# Altium project PCB_Project.PrjPcb
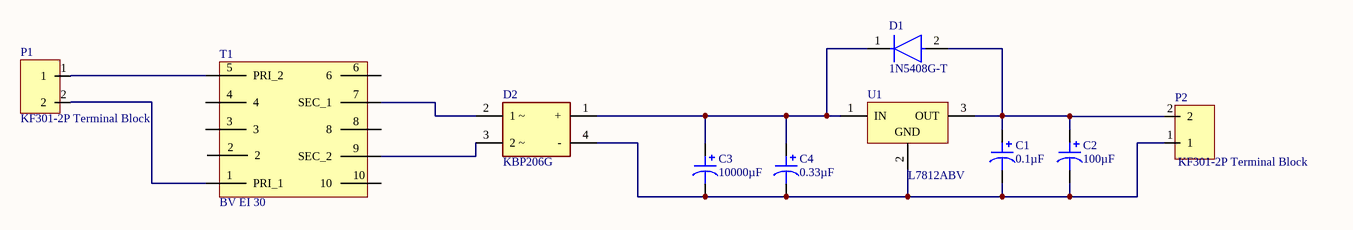
[diagram p0: Sheet2.SchDoc]
1 sheet, 10 parts. Net scope: global (net labels, ports and power ports of the same name join across sheets).
Board file: PCB2.PcbDoc

## Sheet Sheet2.SchDoc
size A4; SheetNumber: 1; SheetTotal: 1

### Parts
C1  0.1µF  [CAP TH ALUM ELEC D5.00mm S2.00mm H12.50mm]
C2  100µF  [CAP TH ALUM ELEC D8.00mm S3.50mm H13.00mm]
C3  10000µF  [CAP TH ALUM ELEC D30.00mm S10.00mm H42.00mm]
C4  0.33µF  [CAP TH ALUM ELEC D4.00mm S1.50mm H6.00mm]
D1  1N5408G-T  [FP-DO-201AD-MFG]
D2  KBP206G  [FP-KBP-MFG]
P1  KF301-2P Terminal Block  [KF301-2P PCB layout]
P2  KF301-2P Terminal Block  [KF301-2P PCB layout]
T1  BV EI 30  [PCBComponent_1]
U1  L7812ABV  [TO220]

### Nets
NetC1_1: C1.1 C2.1 D1.2(A) P2.2 U1.3(OUT)
NetC1_2: C1.2 C2.2 C3.2 C4.2 D2.4(-) P2.1 U1.2(GND)
NetC3_1: C3.1 C4.1 D1.1(C) D2.1(+) U1.1(IN)
NetD2_2: D2.2(1_~) T1.7(SEC_1)
NetD2_3: D2.3(2_~) T1.9(SEC_2)
NetP1_1: P1.1 T1.5(PRI_2)
NetP1_2: P1.2 T1.1(PRI_1)

Not connected (* = marked no-connect by the designer): T1 2 3 4 6 8 10

### Library data of the parts
C1 = 860020672001: CAP ALUM 0.1UF 20% 50V RADIAL; manufacturer: Würth Elektronik; Lifetime @ Temp.: 2000 Hrs @ 105°C; Polarization: Polar; Ripple Current @ High Frequency: 2.21mA @ 100kHz; Ripple Current @ Low Frequency: 1.3mA @ 120Hz; Part Number: 860020672001; Applications: General Purpose; Capacitance: 0.1µF; componentlink1description: Datasheet; componentlink1url: https://katalog.we-online.de/pbs/datasheet/860020672001.pdf; componentlink2description: DigiKey Link; componentlink2url: http://digikey.com/product-detail/en/w-rth-elektronik/860020672001/732-8847-1-ND/5728792; Device Package: Radial, Can; Height - Seated (Max): 0.492" (12.50mm); lastupdated: 4.09.2020 23:29:03; Lead Spacing: 0.079" (2.00mm); Lifecycle Status: Active; Minimum Order: 1; Mounting Type: Through Hole; Operating Temperature: -40°C ~ 105°C; Package / Case: Radial, Can; packaging: TapeAndBox; partid: 22421; Part Status: Active; price: 0.06; series: WCAP-ATG5; Size / Dimension: 0.197" Dia (5.00mm); Supplier 1: DigiKey; Supplier Part Number 1: 732-8847-1-ND; Tolerance: ±20%; value: 0.1µF; Voltage - Rated: 50V
C2 = 50YXG100MEFC8X11.5: CAP ALUM 100UF 20% 50V RADIAL; manufacturer: Rubycon; Impedance: 170 mOhms; Lifetime @ Temp.: 4000 Hrs @ 105°C; Polarization: Polar; Ripple Current @ High Frequency: 555mA @ 100kHz; Ripple Current @ Low Frequency: 277.5mA @ 120Hz; Part Number: 50YXG100MEFC8X11.5; Applications: General Purpose; Capacitance: 100µF; componentlink1description: Datasheet; componentlink1url: http://www.rubycon.co.jp/en/catalog/e_pdfs/aluminum/e_yxg.pdf; componentlink2description: DigiKey Link; componentlink2url: http://digikey.com/product-detail/en/rubycon/50YXG100MEFC8X11.5/1189-4021-ND/3563344; Device Package: Radial, Can; Height - Seated (Max): 0.512" (13.00mm); lastupdated: 7.09.2020 05:24:53; Lead Spacing: 0.138" (3.50mm); Lifecycle Status: Active; Minimum Order: 1; Mounting Type: Through Hole; Operating Temperature: -40°C ~ 105°C; Package / Case: Radial, Can; packaging: Bulk; partid: 23823; Part Status: Active; price: 0.43; series: YXG; Size / Dimension: 0.315" Dia (8.00mm); Supplier 1: DigiKey; Supplier Part Number 1: 1189-4021-ND; Tolerance: ±20%; value: 100µF; Voltage - Rated: 50V
C3 = LLS1H103MELB: CAP ALUM 10000UF 20% 50V SNAP; manufacturer: Nichicon; Lifetime @ Temp.: 3000 Hrs @ 85°C; Polarization: Polar; Ripple Current @ High Frequency: 5.842A @ 50kHz; Ripple Current @ Low Frequency: 5.08A @ 120Hz; Part Number: LLS1H103MELB; Applications: General Purpose; Capacitance: 10000µF; componentlink1description: Datasheet; componentlink1url: http://nichicon-us.com/english/products/pdfs/e-lls.pdf; componentlink2description: DigiKey Link; componentlink2url: http://digikey.com/product-detail/en/nichicon/LLS1H103MELB/493-6156-ND/2548862; Device Package: Radial, Can - Snap-In; Height - Seated (Max): 1.654" (42.00mm); lastupdated: 12.09.2020 10:14:53; Lead Spacing: 0.394" (10.00mm); Lifecycle Status: Active; Minimum Order: 1; Mounting Type: Through Hole; Operating Temperature: -40°C ~ 85°C; Package / Case: Radial, Can - Snap-In; packaging: Bulk; partid: 25520; Part Status: Active; price: 5.09; series: LLS; Size / Dimension: 1.181" Dia (30.00mm); Supplier 1: DigiKey; Supplier Part Number 1: 493-6156-ND; Tolerance: ±20%; value: 10000µF; Voltage - Rated: 50V
C4 = UMP1HR33MDD: CAP ALUM 0.33UF 20% 50V RADIAL; manufacturer: Nichicon; Lifetime @ Temp.: 2000 Hrs @ 85°C; Polarization: Bi-Polar; Ripple Current @ High Frequency: 4.2mA @ 10kHz; Ripple Current @ Low Frequency: 2.8mA @ 120Hz; Part Number: UMP1HR33MDD; Applications: General Purpose; Capacitance: 0.33µF; componentlink1description: Datasheet; componentlink1url: http://nichicon-us.com/english/products/pdfs/e-ump.pdf; componentlink2description: DigiKey Link; componentlink2url: http://digikey.com/product-detail/en/nichicon/UMP1HR33MDD/493-17656-ND/2598755; Device Package: Radial, Can; Height - Seated (Max): 0.236" (6.00mm); lastupdated: 6.09.2020 01:48:30; Lead Spacing: 0.059" (1.50mm); Lifecycle Status: Active; Minimum Order: 1; Mounting Type: Through Hole; Operating Temperature: -40°C ~ 85°C; Package / Case: Radial, Can; packaging: Bulk; partid: 23159; Part Status: Active; price: 0.42; series: UMP; Size / Dimension: 0.157" Dia (4.00mm); Supplier 1: DigiKey; Supplier Part Number 1: 493-17656-ND; Tolerance: ±20%; value: 0.33µF; Voltage - Rated: 50V
D1 = CMP-12791-000058-1: DIODE GEN PURP 1KV 3A DO201AD; Element Configuration: Single; Polarity: Standard; Max Reverse Current: 5uA; Reverse Recovery Time: 2us; Max Surge Current: 125A; Forward Voltage: 1.1V; Capacitance: 40pF; Series: -; Average Rectified Current: 3A; Weight: 0.038801oz; Package Quantity: 1200; RoHS Compliant: Yes; Radiation Hardening: No; Mount: Through Hole; Forward Current: 3A; Length: 9.5mm; Min Operating Temperature: -65°C; Height: 5.3mm; Voltage Rating (DC): 1kV; Number of Pins: 2; Lead Free: Lead Free; Reverse Voltage (DC): 1kV; Output Current: 3A; Max Repetitive Reverse Voltage (Vrrm): 1kV; Case/Package: DO-201AD; Peak Non-Repetitive Surge Current: 125A; Current Rating: 3A; Packaging: Tape and Reel; Max Operating Temperature: 150°C; Recovery Time: 2us; Width: 5.3mm; Max Reverse Voltage (DC): 1kV
D2 = CMP-12791-000035-1: BRIDGE RECT 1PHASE 600V 2A KBP; Manufacturer: Diodes Inc.; Capacitance: 25pF; Max Junction Temp: +150°C; Value: 25pF; Max Surge Forward Current: 65A; Peak Reverse Current: 5uA; Standoff Height: 1.8mm; Octopart: https://octopart.com/kbp206g-diodes+inc.-330175; Footprint Url: https://www.diodes.com/assets/Package-Files/KBP.pdf; Device Class L2: Diodes; Category: Diode; Reverse Voltage: 600V; Device Class L3: Rectifier Diodes; Manufacturer Part Number: KBP206G; Height: 12.8mm; Device Class L1: Discrete Semiconductors; Mouser Description: Bridge Rectifiers 2.0A 600V; ComponentLink2Description: Datasheet; Forward Current: 2A; Automotive: No; RoHS: TRUE; Temperature Range High: +150°C; ComponentLink2URL: https://www.diodes.com/assets/Datasheets/ds21205.pdf; Digikey Description: BRIDGE RECT 1PHASE 600V 2A KBP; Temperature: -65°C to +150°C; Temperature Range Low: -65°C; Package: KBP; Max Repetitive Reverse Voltage: 600V; Lead Free: Yes
P1 P2 = KF301-2P Terminal Block: Rated current: 16A / Withstanding voltage: AC200V/1Min
T1 = BV EI 30: BV EI 30 / Primary Voltage 230V / Seconder Voltage  24V
U1 = CMP-0244-00453-1: Positive Voltage Regulator, 12V, 3-Pin TO-220; ComponentLink3Description: Package Specification; ComponentLink2URL: http://www.st.com/internet/com/TECHNICAL_RESOURCES/TECHNICAL_LITERATURE/DATASHEET/CD00000444.pdf; ComponentLink3URL: http://www.st.com/internet/com/TECHNICAL_RESOURCES/TECHNICAL_LITERATURE/PACKAGE_INFORMATION/CD00004649.pdf; ComponentLink2Description: Datasheet; ComponentLink1URL: http://www.st.com; ComponentLink1Description: Manufacturer URL; PackageReference: TO220; PackageDescription: TO, Thru-Hole, Vertical, Heatsink Mounted; 3 In-Line Leads; Pitch 2.54 mm; PackageVersion: ver3.0; DatasheetVersion: 16/11/2011